# EAGLE design Low Noise PS Bottom SMD (EAGLE 6.6.0)
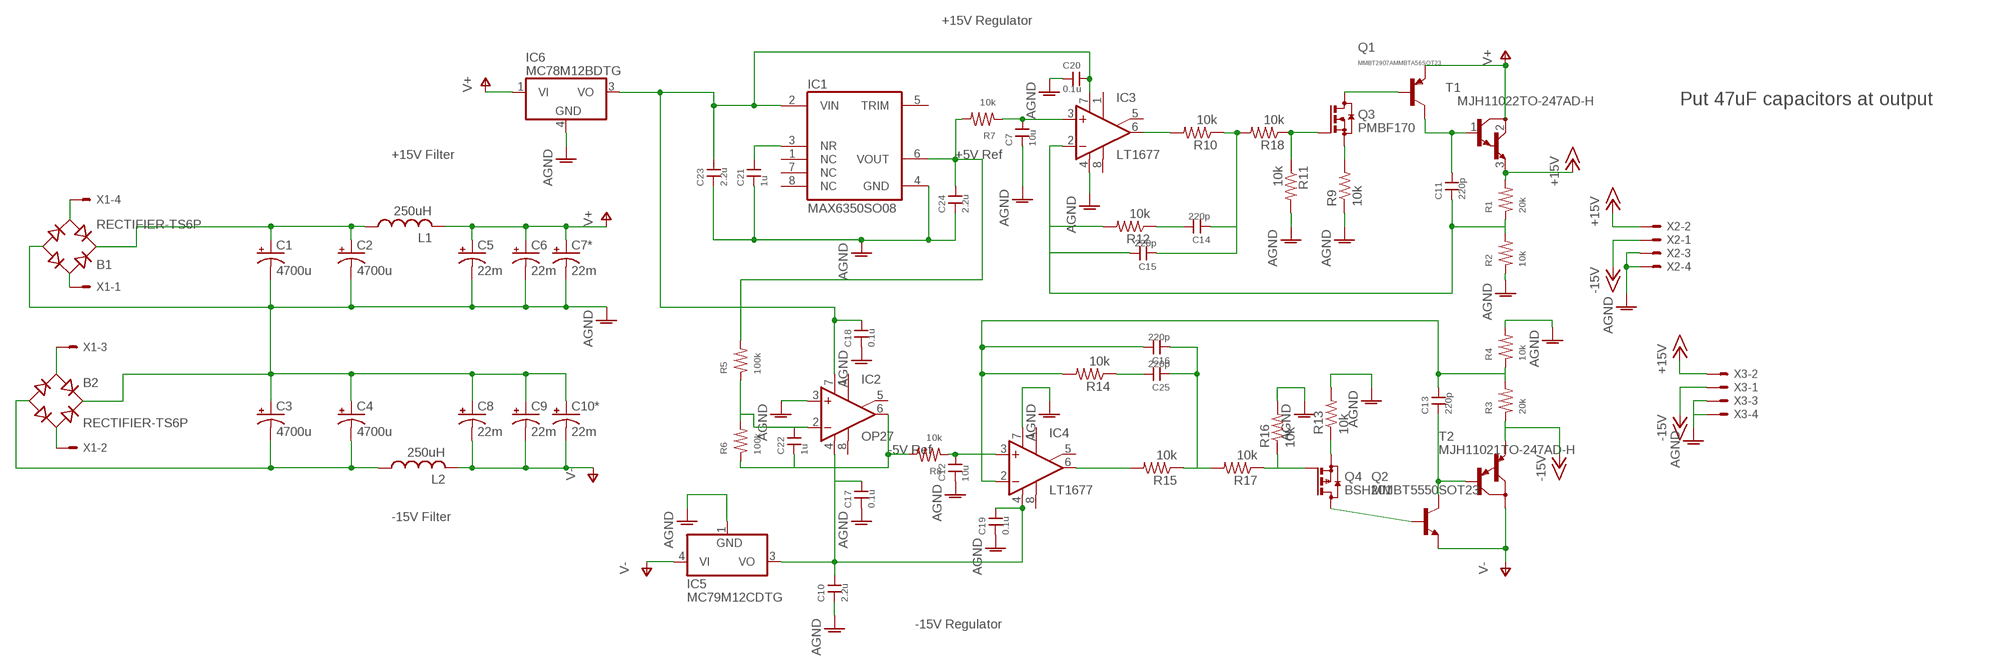
[diagram p0: schematic, sheet 1]

## Parts
B1  RECTIFIER-TS6P  [TS6P]
B2  RECTIFIER-TS6P  [TS6P]
C1  4700u  CPOL-USE7.5-18  [E7,5-18]
C2  4700u  CPOL-USE7.5-18  [E7,5-18]
C3  4700u  CPOL-USE7.5-18  [E7,5-18]
C4  4700u  CPOL-USE7.5-18  [E7,5-18]
C5  22m  CPOL-USEB35D  [EB35D]
C6  22m  CPOL-USEB35D  [EB35D]
C7  10u  CAP1206  [1206]
C7*  22m  CPOL-USEB35D  [EB35D]
C8  22m  CPOL-USEB35D  [EB35D]
C9  22m  CPOL-USEB35D  [EB35D]
C10  2.2u  CAP1206  [1206]
C10*  22m  CPOL-USEB35D  [EB35D]
C11  220p  CAP1206  [1206]
C12  10u  CAP1206  [1206]
C13  220p  CAP1206  [1206]
C14  220p  CAP1206  [1206]
C15  220p  CAP1206  [1206]
C16  220p  CAP1206  [1206]
C17  0.1u  CAP1206  [1206]
C18  0.1u  CAP1206  [1206]
C19  0.1u  CAP1206  [1206]
C20  0.1u  CAP1206  [1206]
C21  1u  CAP1206  [1206]
C22  1u  CAP1206  [1206]
C23  2.2u  CAP1206  [1206]
C24  2.2u  CAP1206  [1206]
C25  220p  CAP1206  [1206]
IC1  MAX6350SO08  [SO08]
IC2  OP27  OPAMP-SO  [SO08]
IC3  LT1677  OPAMP-SO  [SO08]
IC4  LT1677  OPAMP-SO  [SO08]
IC5  MC79M12CDTG  [DPACK_3]
IC6  MC78M12BDTG  [DPACK_3]
L1  250uH  INDUCTOR5721-RC  [5721-RC]
L2  250uH  INDUCTOR5721-RC  [5721-RC]
Q1  MMBT2907AMMBTA56SOT23  [SOT23]
Q2  MMBT5550SOT23  [SOT23]
Q3  PMBF170  [SOT23]
Q4  BSH201  [SOT23]
R1  20k  RES1206  [1206]
R2  10k  RES1206  [1206]
R3  20k  RES1206  [1206]
R4  10k  RES1206  [1206]
R5  100k  RES1206  [1206]
R6  100k  RES1206  [1206]
R7  10k  RES1206  [1206]
R8  10k  RES1206  [1206]
R9  10k  R-US_R1206  [R1206]
R10  10k  R-US_R1206  [R1206]
R11  10k  R-US_R1206  [R1206]
R12  10k  R-US_R1206  [R1206]
R13  10k  R-US_R1206  [R1206]
R14  10k  R-US_R1206  [R1206]
R15  10k  R-US_R1206  [R1206]
R16  10k  R-US_R1206  [R1206]
R17  10k  R-US_R1206  [R1206]
R18  10k  R-US_R1206  [R1206]
T1  MJH11022TO-247AD-H  [TO-247AD-H]
T2  MJH11021TO-247AD-H  [TO-247AD-H]
X1  5566-4RA  [5566-4-RA]
X2  5566-4RA  [5566-4-RA]
X3  5566-4RA  [5566-4-RA]

## Nets
+12V: C18.2 C20.2 C23.2 IC1.2(VIN) IC2.7(V+) IC3.7(V+) IC6.3(VO)
+15V: R1.2 T1.3(E) X2.2 X3.2
-12V: C10.2 C17.2 C19.2 IC2.4(V-) IC4.4(V-) IC5.3(VO)
-15V: R3.1 T2.3(E) X2.1 X3.1
AGND: B1.- B2.+ C1.- C2.- C3.+ C4.+ C5.- C6.- C7*.- C7.1 C8.+ C9.+ C10*.+ C10.1 C12.1 C17.1 C18.1 C19.1 C20.1 C21.1 C23.1 C24.1 IC1.4(GND) IC2.3(+IN) IC3.4(V-) IC4.7(V+) IC5.1(GND) IC6.4(GND) R2.1 R4.2 R9.1 R11.2 R13.2 R16.2 X2.3 X2.4 X3.3 X3.4
N$1: B1.AC1 X1.1
N$2: B1.AC2 X1.4
N$3: B1.+ C1.+ C2.+ L1.P$1
N$4: C21.2 IC1.3(NR)
N$5: B2.AC2 X1.2
N$6: B2.AC1 X1.3
N$7: C24.2 IC1.6(VOUT) R5.2 R7.2
N$8: B2.- C3.- C4.- L2.P$1
N$9: C14.2 R12.1
N$10: C13.1 Q2.3(C) T2.1(B)
N$11: IC3.6(OUT) R10.2
N$12: Q4.1(G) R16.1 R17.1
N$13: C11.2 Q1.3(C) T1.1(B)
N$14: C22.2 IC2.2(-IN) R5.1 R6.2
N$15: C22.1 IC2.6(OUT) R6.1 R8.2
N$16: Q4.2(S) R13.1
N$17: C11.1 C15.2 IC3.2(-IN) R1.1 R2.2 R12.2
N$18: IC4.6(OUT) R15.2
N$19: C7.2 IC3.3(+IN) R7.1
N$20: Q2.1(B) Q4.3(D)
N$21: C12.2 IC4.3(+IN) R8.1
N$23: C13.2 C16.2 IC4.2(-IN) R3.2 R4.1 R14.2
N$25: Q3.1(G) R11.1 R18.1
N$27: C25.2 R14.1
N$28: C16.1 C25.1 R15.1 R17.2
N$33: Q1.1(B) Q3.3(D)
N$34: Q3.2(S) R9.2
N$35: C14.1 C15.1 R10.1 R18.2
V+: C5.+ C6.+ C7*.+ IC6.1(VI) L1.P$2 Q1.2(E) T1.2(C)
V-: C8.- C9.- C10*.- IC5.4(VI) L2.P$2 Q2.2(E) T2.2(C)
Unconnected: IC1.1(NC) IC1.5(TRIM) IC1.7(NC) IC1.8(NC) IC2.1(ON1) IC2.5(ON2) IC2.8(OPT) IC3.1(ON1) IC3.5(ON2) IC3.8(OPT) IC4.1(ON1) IC4.5(ON2) IC4.8(OPT)

## Notes on the sheet
- +15V Regulator
- Put 47uF capacitors at output
- +15V Filter | +5V Ref
- -5V Ref
- -15V Filter
- -15V Regulator

## Library data of the parts
B1 B2 = jqi-power-supply:RECTIFIER-: Rectifier; DIGIKEY: DFB2005-ND
C1-C4 = jqi-power-supply:CPOL-US; DIGIKEY: 495-6089-ND
C5 C6 C7* C8 C9 C10* = jqi-power-supply:CPOL-US; DIGIKEY: 565-2880-ND
C7 C12 = rlc-jqi:CAP: SMT Capacitor; DIGIKEY: 445-12883-2-ND; VMAX: 50
C10 C11 C13-C25 = rlc-jqi:CAP: SMT Capacitor
IC1 = jqi-power-supply:MAX6350: VOLATAGE REFERENCE; DIGIKEY: MAX6350CSA+-ND
IC2-IC4 = opamp-jqi:OPAMP: Basic Op Amp. Be sure to check actual pinout of your device, and modify as necessary!
IC5 = linear:MC79M: 500 mA Negative Voltage Regulators Source: Data sheet <http://www.onsemi.com/pub_link/Collateral/MC79M00-D.PDF>; DIGIKEY: MC79M12CDTGOS-ND
IC6 = linear:MC78M: 500 mA Positive Voltage Regulators Source: Data sheet <http://www.onsemi.com/pub_link/Collateral/MC78M00-D.PDF>; DIGIKEY: MC78M12BDTGOS-ND
L1 L2 = jqi-power-supply:INDUCTOR; DIGIKEY: M8725-ND
Q1 = jqi-power-supply:MMBT2907A: PNP Transistor; DIGIKEY: MMBT2907AFSCT-ND
Q2 = jqi-power-supply:MMBT5550: NPN Transistor
Q3 = jqi-power-supply:PMBF170: N-CHANNEL MOS FET
Q4 = jqi-power-supply:BSH201: P-CHANNEL MOS FET
R1-R8 = rlc-jqi:RES: SMT Resistor
R9-R18 = rcl:R-US_: RESISTOR, American symbol
T1 = jqi-power-supply:MJH11022: NPN POWER DARLINGTON TRANSISTOR 15A, 250V; DIGIKEY: MJH11022GOS-ND
T2 = jqi-power-supply:MJH11021: PNP POWER DARLINGTON TRANSISTOR 15A, 250V; DIGIKEY: MJH11021GOS-ND
X1-X3 = jqi-power-supply:5566-4: Mini FIT connector 4 pol Source: http://www.molex.com; DIGIKEY: WM1352-ND

## Board
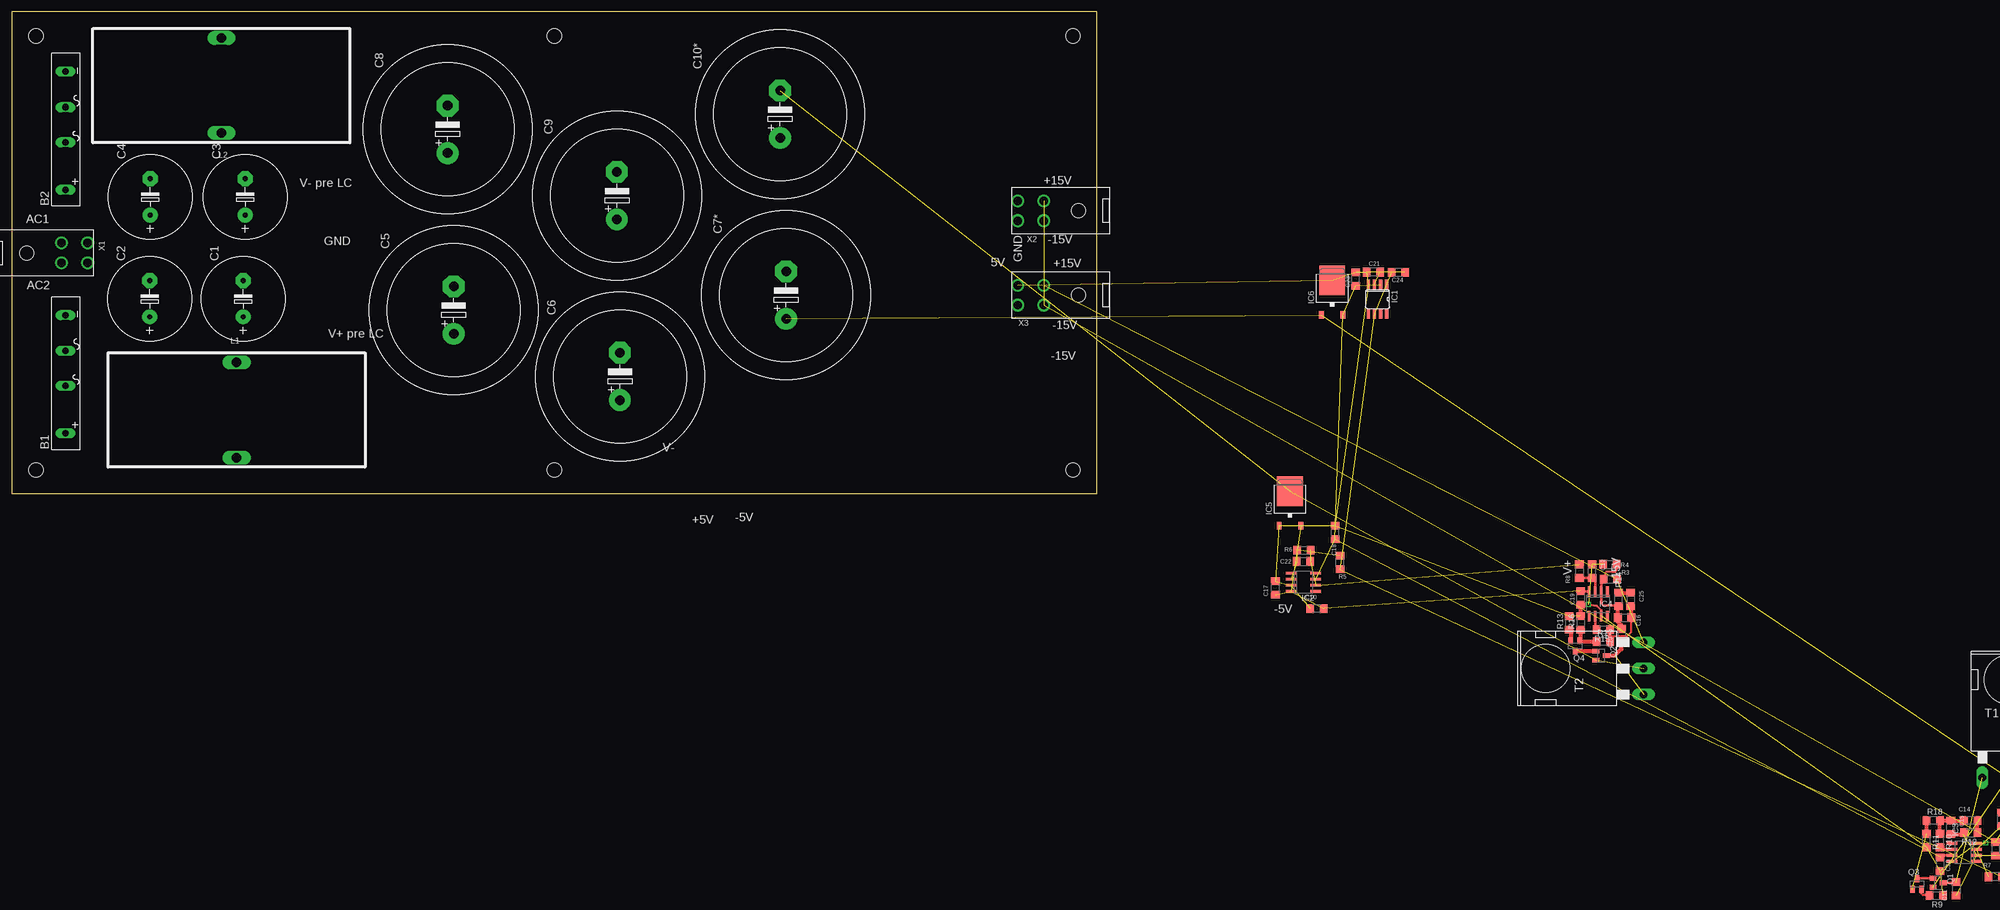
[diagram p1: board, top side]
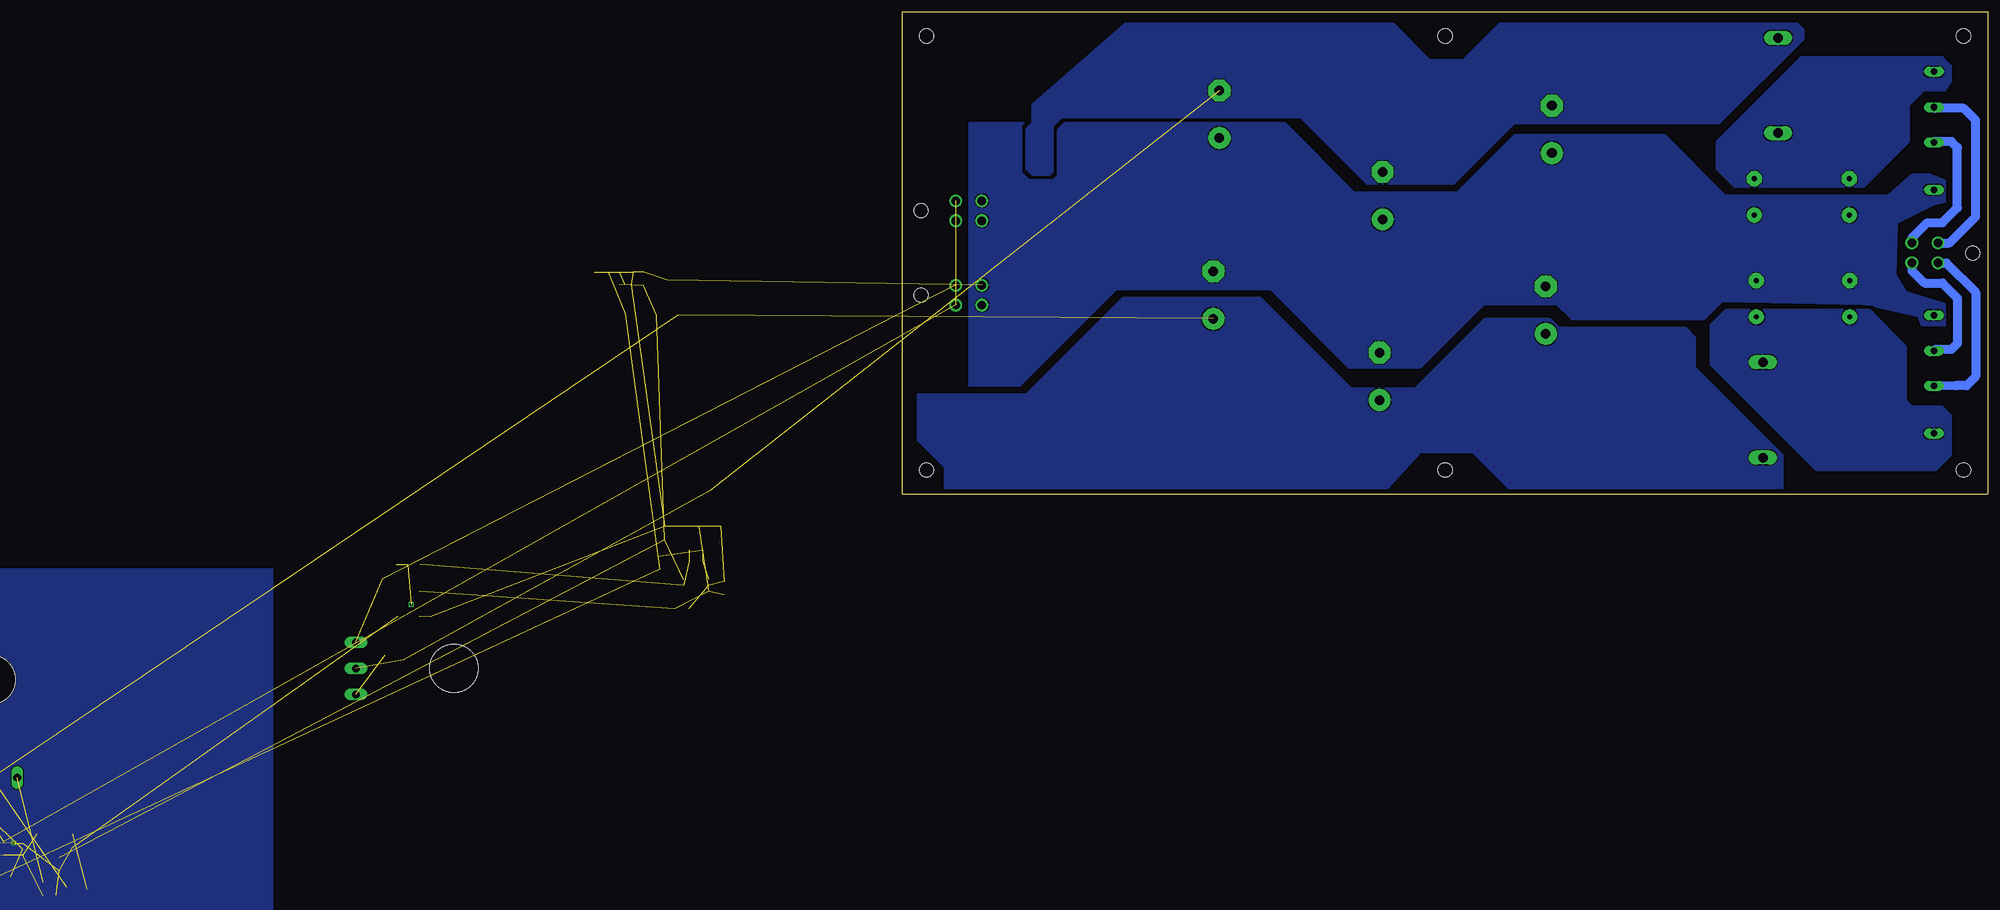
[diagram p2: board, bottom side, seen from below]

Size 228.6 x 101.6 mm. Coordinates in mm from the lower left corner, seen from the top.
Outline: 228.6,0 228.6,101.6 0,101.6 0,0 228.6,0
Copper layers (1*16): Top 0.035mm / dielectric 1.5mm / Bottom 0.035mm
Design rules "default *": minimum track width 10mil, minimum drill 24mil, track to track 8mil, track to pad 8mil, pad to pad 8mil, via to via 8mil, smd to smd 8mil, copper to edge 10mil, drill to drill 8mil, minimum pad ring 10mil, minimum via ring 8mil, stop-mask expansion 4mil, vias tented up to drill 0mil, thermal gap 10mil
Holes 3.05 mm at 223.52,5.08 223.52,96.52 5.08,96.52 5.08,5.08 114.3,96.52 114.3,5.08

### Footprints (pad centres in the part's own frame; a part is rotated, then mirrored left to right if it is on the bottom)
TS6P = drill 1.397 long: + -13.7,0; - 11.2,0; AC1 -3.7,0; AC2 3.7,0
E7,5-18 = drill 1.016 pad 3.15: + -3.81,0 | drill 1.016 pad 3.15 octagon: - 3.81,0
EB35D = drill 2.007 pad 4.597: + -5,0 | drill 2.007 pad 4.597 octagon: - 5,0
1206 = smd 1.6 x 1.803: 1 -1.422,0; 2 1.422,0
SO08 = smd 0.66 x 2.032: 1 -1.905,-3.073; 2 -0.635,-3.073; 3 0.635,-3.073; 4 1.905,-3.073; 5 1.905,3.073; 6 0.635,3.073; 7 -0.635,3.073; 8 -1.905,3.073
SO08' = smd 2.2 x 0.6: 1 -2.6,1.27; 2 -2.6,0; 3 -2.6,-1.27; 4 -2.6,-2.54; 5 2.6,-2.54; 6 2.6,-1.27; 7 2.6,0; 8 2.6,1.27
DPACK_3 = smd 1 x 1.6: 1 -2.28,-4.8; 3 2.28,-4.8 | smd 5.4 x 6.2: 4 0,2.5
5721-RC = drill 2 long: P$1 0,10.033; P$2 0,-10.033
SOT23 = smd 1 x 1.4: 1 -0.95,-1.1; 2 0.95,-1.1; 3 0,1.1
R1206 = smd 1.6 x 1.803: 1 -1.422,0; 2 1.422,0
TO-247AD-H = drill 1.6 long: 1 -5.5,-20.65; 2 0,-20.65; 3 5.5,-20.65 | hole 10.16: 0,0
5566-4-RA = drill 1.778: 1 2.095,-2.756; 2 -2.095,-2.756; 3 -2.095,2.756; 4 2.095,2.756 | hole 3: 0,-10.046

### Placement (x,y rotation side)
B1  11.3,26.48 90 top
B2  11.3,77.81 90 top
C1  48.7,41.15 90 top
C2  29.04,41.15 90 top
C3  49.14,62.61 90 top
C4  29.12,62.61 90 top
C5  93.06,38.76 90 top
C6  128.09,24.79 90 top
C7  419.1,-68.58 270 top  (outside the outline)
C7*  163.12,41.94 90 top
C8  91.8,76.86 90 top
C9  127.45,62.88 90 top
C10  274.95,-24.13 0 top  (outside the outline)
C10*  161.84,80.03 90 top
C11  409.57,-83.19 90 top  (outside the outline)
C12  332.87,-16.26 270 top  (outside the outline)
C13  339.09,-29.84 90 top  (outside the outline)
C14  412.62,-68.83 0 top  (outside the outline)
C15  408.43,-70.23 270 top  (outside the outline)
C16  339.73,-26.04 180 top  (outside the outline)
C17  266.18,-19.79 270 top  (outside the outline)
C18  278.76,-8.14 270 top  (outside the outline)
C19  330.43,-21.88 90 top  (outside the outline)
C20  406.2,-78.01 90 top  (outside the outline)
C21  286.81,46.77 0 top  (outside the outline)
C22  272.1,-14.2 180 top  (outside the outline)
C23  283.1,45.29 270 top  (outside the outline)
C24  292.07,46.75 180 top  (outside the outline)
C25  341,-22.23 90 top  (outside the outline)
IC1  287.69,41.06 180 top  (outside the outline)
IC2  OP27  [SO08']  272.09,-17.95 0 top  (outside the outline)
IC3  LT1677  [SO08']  411.3,-76.15 180 top  (outside the outline)
IC4  LT1677  [SO08']  334.8,-23.12 270 top  (outside the outline)
IC5  269.24,-1.91 0 top  (outside the outline)
IC6  278.13,42.55 0 top  (outside the outline)
L1  47.34,17.73 0 top
L2  44.13,86.08 180 top
Q1  405.76,-81.92 270 top  (outside the outline)
Q2  334.77,-34.04 270 top  (outside the outline)
Q3  401.32,-82.17 0 top  (outside the outline)
Q4  329.31,-32 180 top  (outside the outline)
R1  417.88,-74.74 90 top  (outside the outline)
R2  420.33,-74.77 270 top  (outside the outline)
R3  336.71,-17.92 180 top  (outside the outline)
R4  336.64,-14.82 180 top  (outside the outline)
R5  279.78,-14.46 270 top  (outside the outline)
R6  272.17,-11.82 180 top  (outside the outline)
R7  417.83,-80.64 0 top  (outside the outline)
R8  330.2,-16.26 90 top  (outside the outline)
R9  405.38,-84.58 180 top  (outside the outline)
R10  406.15,-73.03 270 top  (outside the outline)
R11  403.35,-73.03 270 top  (outside the outline)
R12  412.62,-71.37 180 top  (outside the outline)
R13  328.04,-27.18 90 top  (outside the outline)
R14  338.45,-22.23 270 top  (outside the outline)
R15  335.28,-28.57 180 top  (outside the outline)
R16  330.45,-27.18 90 top  (outside the outline)
R17  335.28,-31.11 0 top  (outside the outline)
R18  404.75,-68.83 0 top  (outside the outline)
T1  420.58,-39.11 0 top  (outside the outline)
T2  323.09,-36.76 90 top  (outside the outline)
X1  13.21,50.8 270 top
X2  214.63,59.69 90 top
X3  214.63,41.91 90 top

### Tracks (layer width: path | path; a pad name or v marks a point on that pad's centre or on a via)
+12V  (5 unrouted)
  Top 0.508: 408.75,-76.2 IC3.7 406.64,-76.15 C20.2
+15V  (3 unrouted)
-12V  (4 unrouted)
  Top 0.508: IC4.4 330.49,-20.52 C19.2
-15V  (3 unrouted)
AGND  (via drill 0.6)  (21 unrouted)
  Top 0.406: 415.72,-73.61 v415.8,-73.53
  Top 0.508: 332.04,-23.3 v332.11,-23.24 333.88,-23.62 334.8,-24.53 IC4.7
  Top 0.813: C19.1 330.43,-25.73 R16.2
  Top 1.016: C19.1 332.04,-23.3
  pour Bottom (isolate 0.635, rank 2): 17.14,42.55 19.3,46.1 19.05,57.15 11.43,60.96 8.89,61.59 8.89,66.04 12.06,67.31 15.88,67.31 20.95,62.87 55.24,62.87 67.94,75.56 99.69,75.56 111.76,63.5 133.35,63.5 147.96,78.11 214.63,78.11 214.63,22.86 203.84,22.86 183.51,43.18 151.13,43.18 134.62,26.67 119.38,26.67 106.05,40.01 90.81,40.01 87.63,36.83 59.69,36.83 55.88,40.64 26.04,40.01 14.61,37.47 13.97,35.56 8.89,35.56 8.89,40.01
  pour Bottom: 361.31,-15.88 446.4,-15.88 446.4,-104.14 361.31,-104.14
N$1
  Bottom 1.93: X1.1 8.7,48.7 2.54,42.55 2.54,24.77 4.45,22.86 6.77,22.86 B1.AC1
N$2
  Bottom 1.93: X1.4 15.96,47.08 13.34,44.45 9.53,44.45 6.35,41.27 6.35,31.75 7.62,30.48 11,30.48 B1.AC2
N$3
  pour Bottom: 7.62,14.61 7.62,16.51 9.53,18.41 15.88,18.41 17.14,19.68 17.14,31.11 24.77,38.73 55.24,38.73 58.42,35.56 58.42,27.3 36.2,5.08 10.79,5.08 7.62,8.26
N$4  (1 unrouted)
N$5
  Bottom 1.93: X1.2 8.06,52.9 2.54,58.42 2.54,78.74 5.08,81.28 11.08,81.28 B2.AC2
N$6
  Bottom 1.93: X1.3 15.96,53.89 12.7,57.15 9.53,57.15 6.35,60.33 6.35,73.03 7.62,74.3 11.11,74.3 B2.AC1
N$7  (3 unrouted)
N$8
  pour Bottom: 7.62,90.17 9.53,92.08 39.37,92.08 57.15,74.3 57.15,68.58 53.34,64.77 26.04,64.77 16.51,74.3 16.51,81.92 13.34,85.09 8.89,85.09 7.62,87
N$9
  Top 0.889: R12.1 C14.2
N$10  (1 unrouted)
  Top 0.813: Q2.3 337.69,-34.04 339.09,-32.64 C13.1
N$11
  Top 0.406: 405.95,-74.83 R10.2 406.58,-74.88 IC3.6
N$12
  Top 0.813: R16.1 330.45,-30.71 Q4.1 330.47,-31.11 R17.1
N$13  (1 unrouted)
  Top 0.508: Q1.3 409.42,-81.92 C11.2
N$14  (3 unrouted)
N$15  (3 unrouted)
N$16
  Top 0.813: R13.1 328.36,-28.92 Q4.2
N$17  (4 unrouted)
  Top 0.406: 411.23,-71.4 R12.2 | 409.45,-84.73 C11.1
  Top 0.889: C15.2 410.92,-71.65 R12.2
N$18
  Top 0.508: IC4.6 333.52,-28.24 R15.2
N$19  (2 unrouted)
N$20
  Top 0.813: Q4.3 329.33,-33.09 Q2.1
N$21
  Top 0.508: 332.87,-17.91 333.52,-18.44 IC4.3 | R8.1 C12.2
  Top 0.813: C12.2 332.87,-17.91
N$23
  Top 0.406: R3.2 335.79,-16.38 337.06,-16.38 337.82,-16.38 338.07,-16 338.07,-14.84 R4.1
  Top 0.508: R14.2 338.3,-23.5 335.28,-23.5 334.8,-23.01 IC4.2 334.8,-18.16 R3.2
  Top 0.813: C13.2 338.96,-28.3 338.96,-27.56 338.3,-26.9 C16.2
  Top 0.889: C16.2 338.3,-23.8 R14.2
N$25  (1 unrouted)
  Top 0.508: 403.55,-68.62 R18.1
  Top 0.813: R11.1 403.35,-68.83 R18.1
N$27
  Top 0.889: R14.1 C25.2
N$28
  Top 0.406: 336.55,-29.84 340.36,-29.84 341.15,-29.06 C16.1
  Top 0.813: R15.1 336.55,-28.73 336.55,-29.84 336.55,-30.96 R17.2
  Top 0.889: C16.1 341.15,-23.8 C25.1
N$33
  Top 0.508: Q1.1 401.42,-80.97 Q3.3
N$34
  Top 0.508: Q3.2 402.27,-84.14 402.59,-84.45 403.83,-84.45 R9.2
N$35
  Top 0.813: R10.1 406.15,-68.83 R18.2 408.41,-68.83
  Top 0.889: 408.41,-68.83 C15.1 411.18,-68.81 C14.1
V+  (3 unrouted)
  pour Bottom (isolate 0.635): 43.18,8.26 61.59,26.67 61.59,33.02 63.5,34.92 90.17,34.92 92.08,36.83 106.05,36.83 120.65,22.23 133.99,22.23 153.03,41.27 182.25,41.27 202.56,20.95 225.43,20.95 225.43,11.43 219.71,5.71 219.71,1.27 126.36,1.27 119.38,8.89 108.58,8.89 100.97,1.27 43.18,1.27
V-  (3 unrouted)
  pour Bottom (isolate 0.635): 40.01,99.06 102.87,99.06 110.49,91.44 117.47,91.44 125.09,99.06 181.61,99.06 201.29,81.92 201.29,78.11 202.56,76.83 202.56,68.58 201.29,67.31 197.49,67.31 196.85,67.94 196.85,77.47 194.94,79.38 144.78,79.38 130.81,65.41 112.39,65.41 99.69,78.11 56.52,78.11 38.73,95.89 38.73,97.79

### Text on the board
tNames: V- pre LC | +15V | AC1 | -15V | GND | GND | 5V | +15V | AC2 | -15V | V+ pre LC | -15V | V- | +5V | -5V | V+ | +15V | -5V